# Altium project EL.T01.CVCM.PrjPcb (part 2 of 2)

## Sheet ISO_I2C.SchDoc
size A4; SheetNumber: 5; SheetTotal: 7
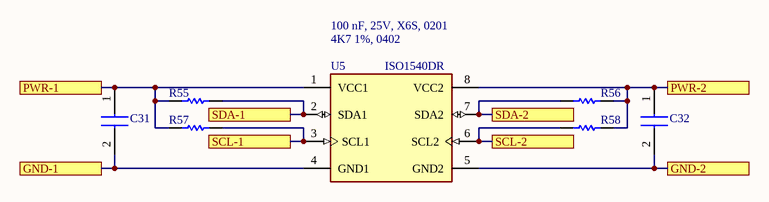
[diagram p4: ISO_I2C.SchDoc]

### Parts
C31  100 nF, 25V, X6S, 0201  [CAPC0603X33N]  (value not drawn)
C32  100 nF, 25V, X6S, 0201  [CAPC0603X33N]  (value not drawn)
R55  4K7 1%, 0402  [RESC1005X40X25LL05T05]  (value not drawn)
R56  4K7 1%, 0402  [RESC1005X40X25LL05T05]  (value not drawn)
R57  4K7 1%, 0402  [RESC1005X40X25LL05T05]  (value not drawn)
R58  4K7 1%, 0402  [RESC1005X40X25LL05T05]  (value not drawn)
U5  ISO1540DR  [FP-D0008A-MFG]

### Ports
GND-1 (see CellVoltageControl[2C]), GND-2 (see CellVoltageControl[3C]), PWR-1 (see CellVoltageControl[2C]), PWR-2 (see CellVoltageControl[3C]), SCL-1 (see CellVoltageControl[2C]), SCL-2 (see CellVoltageControl[3C]), SDA-1 (see CellVoltageControl[2C]), SDA-2 (see CellVoltageControl[3C])

### Nets
3V3: C31.1 R55.2 R57.2 U5.1(VCC1) ; port PWR-1
GND: C31.2 U5.4(GND1) ; port GND-1
ISO_5V: C32.1 R56.1 R58.1 U5.8(VCC2) ; port PWR-2
ISO_GND: C32.2 U5.5(GND2) ; port GND-2
ISO_SCL: R58.2 U5.6(SCL2) ; port SCL-2
ISO_SDA: R56.2 U5.7(SDA2) ; port SDA-2
SCL: R55.1 U5.2(SDA1) ; port SDA-1
SDA: R57.1 U5.3(SCL1) ; port SCL-1

### Notes on the sheet
- 100 nF, 25V, X6S, 0201
- (near U5) 4K7 1%, 0402

### Library data of the parts
C31 C32 = GRM033C81E104KE14D: Capacitor; Manufacturer_Name: Murata Electronics; Datasheet Link: https://search.murata.co.jp/Ceramy/image/img/A01X/G101/ENG/GRM033C81E104KE14-01A.pdf; Height: 0.33mm; Manufacturer_Part_Number: GRM033C81E104KE14D; Mouser Part Number: 81-GRM33C81E104KE14D; Mouser Price/Stock: https://www.mouser.co.uk/ProductDetail/Murata-Electronics/GRM033C81E104KE14D?qs=P%2FC4Eoq9CDwxe7d5nXqGrA%3D%3D; Arrow Part Number: GRM033C81E104KE14D; Arrow Price/Stock: https://www.arrow.com/en/products/grm033c81e104ke14d/murata-manufacturing
R55-R58 = CMP-2002-01154-4: Chip Resistor, 4.7 KOhm, +/- 1%, 0.1 W, -55 to 155 degC, 0402 (1005 Metric), RoHS, Tape and Reel; PartNumber: ERJ-2RKF4701X; Voltage Rating: 50 V; Case\/Package: 0402; Power Rating: 100 mW; Height: 0.35 mm; Mounting Technology: Surface Mount; REACH SVHC: Yes; Resistance: 4.7 KOhm; Max Operating Temperature: 155 degC; ComponentLink1Description: Manufacturer URL; ComponentLink2Description: Datasheet; Pins: 2; PackageReference: 0402; Tolerance: 1%; Case Code (Imperial): 0402; Length: 1 mm; PackageDescription: 2-Pin Surface Mount Device, Body 1 x 0.5 mm; RoHSCompliant: true; Package Quantity: 1; Radiation Hardening: No; DatasheetVersion: 04/2015; Width: 0.5 mm; Case Code (Metric): 1005; Mount: Surface Mount; ComponentLink1URL: http://www.panasonic.com/; Min Operating Temperature: -55 degC; Packaging: Cut Tape; ComponentLink2URL: http://industrial.panasonic.com/cdbs/www-data/pdf/RDA0000/AOA0000C86.pdf
U5 = CMP-04872-000011-1: DGTL ISO 2.5KV 2CH I2C 8SOIC; Manufacturer: Texas Instruments; Max Supply Voltage: 5.5V; Interface: I2C,SMBus,Other; Nominal Supply Current: 1.7-3.1mA; Standoff Height: 0.11mm; Max Junction Temp: +136°C; Min Supply Voltage: 3V; Ipc Land Pattern Name: SOIC127P600X175-8; Ambient Temperature Range Low: -40°C; Temperature: -40°C to +125°C; Device Class L3: unset; Mouser Description: Digital Isolators Low-Power,Bidirec I2C Iso; Manufacturer Part Number: ISO1540DR; Octopart: https://octopart.com/iso1540dr-texas+instruments-24334113; Digikey Description: DGTL ISO 2.5KV 2CH I2C 8SOIC; Category: IC; Height: 1.75mm; Ambient Temperature Range High: +125°C; RoHS: TRUE; Automotive: No; Package: D0008A; ComponentLink2URL: http://www.ti.com/lit/ds/symlink/iso1540.pdf; Device Class L2: Interface ICs; Device Class L1: Integrated Circuits (ICs); Temperature Range Low: -40°C; Lead Free: Yes; ComponentLink2Description: Datasheet; Temperature Range High: +125°C

## Sheet Single-ADC_ADS1252U.SchDoc
size A4; SheetNumber: 6; SheetTotal: 7
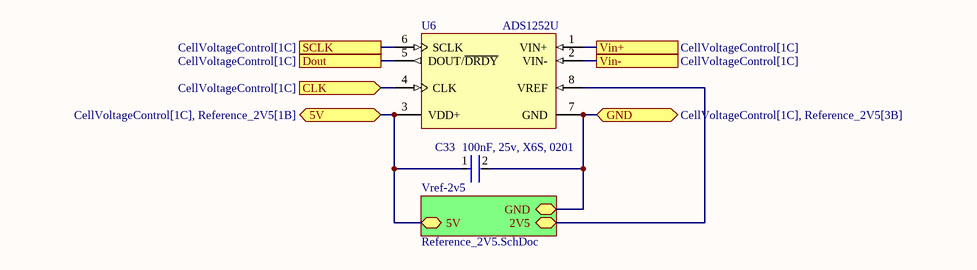
[diagram p5: Single-ADC_ADS1252U.SchDoc]

### Parts
C33  100nF, 25v, X6S, 0201  [FP-GRM033-0_03-IPC_B]
U6  ADS1252U  [TI-D8_M]

### Sub-sheets
Vref-2v5 = Reference_2V5.SchDoc: 2V5 (bidir), 5V (bidir), GND (bidir)

### Ports
5V (bidir, see CellVoltageControl[1C], Reference_2V5[1B]), CLK (in, see CellVoltageControl[1C]), Dout (see CellVoltageControl[1C]), GND (bidir, see CellVoltageControl[1C], Reference_2V5[3B]), SCLK (see CellVoltageControl[1C]), Vin+ (see CellVoltageControl[1C]), Vin- (see CellVoltageControl[1C])

### Nets
ISO_5V: C33.1 U6.3(VDD+) ; port 5V, sheet Vref-2v5/5V
ISO_GND: C33.2 U6.7(GND) ; port GND, sheet Vref-2v5/GND
ISO_SCL: U6.6(SCLK) ; port SCLK
ISO_SDA: U6.5(DOUT/~{DRDY}) ; port Dout
V+: U6.1(VIN+) ; port Vin+
NetC20_2: U6.8(VREF) ; sheet Vref-2v5/2V5
NetU6_2: U6.2(VIN-) ; port Vin-
NetU6_4: U6.4(CLK) ; port CLK

### Library data of the parts
C33 = CMP-06035-023320-1: Chip Multilayer Ceramic Capacitors for General Purpose, 0201, 0.10uF, X6S, 22%, 10%, 25V; Height: 0.3mm; Width: 0.3mm; Weight: 1.2E-05oz; Min Operating Temperature: -55°C; Dielectric: X6S; Packaging: Tape and Reel; Tolerance: 10%; Mount: Surface Mount; Case Code (Imperial): 0201; Case/Package: 0201; Max Operating Temperature: 105°C; Case Code (Metric): 0603; Voltage Rating: 25V; Capacitance: 100nF; Package Quantity: 15000; Thickness: 0.013inch; Length: 0.024inch; Termination: SMD/SMT; Voltage Rating (DC): 25V
U6 = CMP-0003-00072-2: ResolutionPlus 24-Bit, 40 kHz ADC, -40 to 85 degC, 8-pin SOIC (D8), Green (RoHS & no Sb/Br); Manufacturer: Texas Instruments; Analog Voltage AV/DD(Max)(V): 5.25; # Input Channels: 1; Architecture: Delta-Sigma; Sample Rate (max)(SPS): 41k; Digital Supply(Min)(V): 4.75; Resolution(Bits): 24; Interface: Serial SPI; SubFamily: Precision ADC (<=10MSPS); ComponentLink1URL: http://www.ti.com/; Code_JEDEC: MS-012; ComponentLink3Description: Package Specification; PackageVersion: 4040047-3/M, 06/2011; PackageReference: D8; ComponentLink2URL: http://www.ti.com/general/docs/lit/getliterature.tsp?genericPartNumber=ADS1252&fileType=pdf; INL(Max)(+/-LSB): 1; DatasheetVersion: SBAS127D; ComponentLink3URL: http://www.ti.com/litv/pdf/msoi002j; Mounting Technology: Surface Mount; ComponentLink1Description: Manufacturer URL; PackageDescription: 8-Pin Plastic Small Outline, Body 4.9 x 3.9 mm, Pitch 1.27 mm; PartNumber: ADS1252U; Analog Voltage AV/DD(Min)(V): 4.75; ComponentLink2Description: Datasheet; Eco-Plan: Green (RoHS & no Sb/Br); Digital Supply(Max)(V): 5.25

## Sheet Reference_2V5.SchDoc
size A4; SheetNumber: 7; SheetTotal: 7
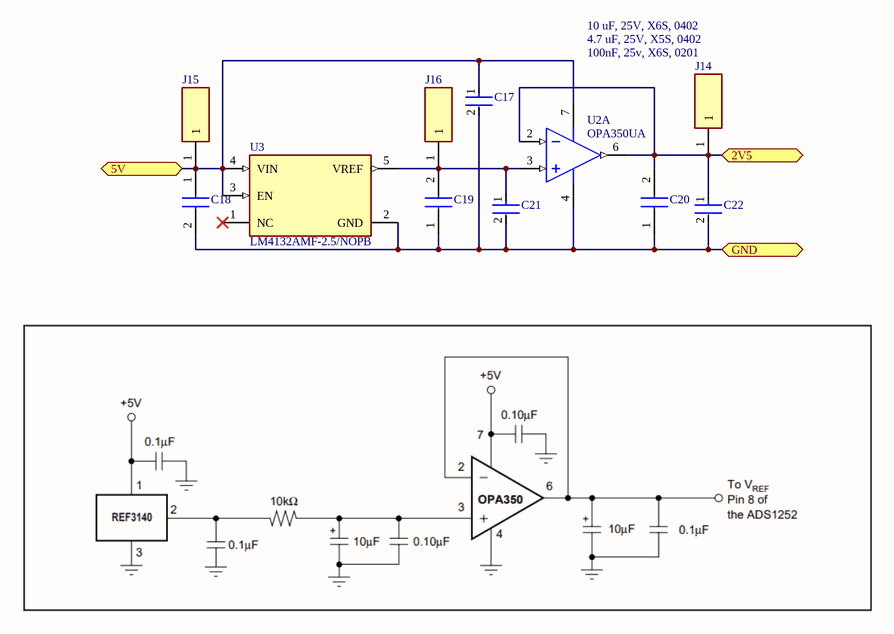
[diagram p6: Reference_2V5.SchDoc]

### Parts
C17  100nF, 25v, X6S, 0201  [FP-GRM033-0_03-IPC_B]  (value not drawn)
C18  10 uF, 25V, X6S, 0402  [CAPC1005X70N]  (value not drawn)
C19  4.7 uF, 25V, X5S, 0402  [GRM15x]  (value not drawn)
C20  10 uF, 25V, X6S, 0402  [CAPC1005X70N]  (value not drawn)
C21  100nF, 25v, X6S, 0201  [FP-GRM033-0_03-IPC_B]  (value not drawn)
C22  100nF, 25v, X6S, 0201  [FP-GRM033-0_03-IPC_B]  (value not drawn)
J14  TestPad  [TestPad]  (value not drawn)  (no BOM)
J15  TestPad  [TestPad]  (value not drawn)  (no BOM)
J16  TestPad  [TestPad]  (value not drawn)  (no BOM)
U2  OPA350UA  [D0008A_M]  (part A of 2)
U3  LM4132AMF-2.5/NOPB  [FP-DBV0005A-IPC_C]

### Ports
2V5 (bidir, see Single-ADC_ADS1252U[3C]), 5V (bidir, see Single-ADC_ADS1252U[2C]), GND (bidir, see Single-ADC_ADS1252U[3C])

### Nets
ISO_5V: C17.1 C18.1 J15.1 U2.7(V+) U3.3(EN) U3.4(VIN) ; port 5V
ISO_GND: C17.2 C18.2 C19.1 C20.1 C21.2 C22.2 U2.4(V-) U3.2(GND) ; port GND
NetC19_2: C19.2 C21.1 J16.1 U2.3(IN+) U3.5(VREF)
NetC20_2: C20.2 C22.1 J14.1 U2.2(IN-) U2.6(OUT) ; port 2V5

Not connected (* = marked no-connect by the designer): U3 1(NC)*

### Notes on the sheet
- 10 uF, 25V, X6S, 0402
- 100nF, 25v, X6S, 0201
- 4.7 uF, 25V, X5S, 0402

### Library data of the parts
C17 C21 C22 = CMP-06035-023320-1: as C33 on sheet Single-ADC_ADS1252U; Height: 0.3mm; Width: 0.3mm; Weight: 1.2E-05oz; Min Operating Temperature: -55°C; Dielectric: X6S; Packaging: Tape and Reel; Tolerance: 10%; Mount: Surface Mount; Case Code (Imperial): 0201; Case/Package: 0201; Max Operating Temperature: 105°C; Case Code (Metric): 0603; Voltage Rating: 25V; Capacitance: 100nF; Package Quantity: 15000; Thickness: 0.013inch; Length: 0.024inch; Termination: SMD/SMT; Voltage Rating (DC): 25V
C18 C20 = GRM155F51E104ZA01E: Capacitor; Manufacturer_Name: Murata Electronics; Datasheet Link: http://www.murata.com/~/media/webrenewal/support/library/catalog/products/capacitor/mlcc/c02e.pdf; Height: 0.7mm; Manufacturer_Part_Number: GRM155F51E104ZA01E; Mouser Part Number: 81-GRM15F51E104ZA01E; Mouser Price/Stock: https://www.mouser.com/Search/Refine.aspx?Keyword=81-GRM15F51E104ZA01E
C19 = GRM155C61E475ME15J: Capacitor; Manufacturer_Name: Murata Electronics; Datasheet Link: https://search.murata.co.jp/Ceramy/image/img/A01X/G101/ENG/GRM155C61E475ME15-01A.pdf; Height: 0.33mm; Manufacturer_Part_Number: GRM155C61E475ME15J; Mouser Part Number: 81-GRM15C61E475ME15J; Mouser Price/Stock: https://www.mouser.co.uk/ProductDetail/Murata-Electronics/GRM155C61E475ME15J?qs=By6Nw2ByBD02p8xq06vhEQ%3D%3D; Arrow Part Number: GRM155C61E475ME15J; Arrow Price/Stock: https://www.arrow.com/en/products/grm155c61e475me15j/murata-manufacturing?region=nac
J14-J16 = 61300111121: Connector; Manufacturer_Name: Wurth Elektronik; Datasheet Link: https://katalog.we-online.de/em/datasheet/6130xx11121.pdf; Height: 8.89mm; Manufacturer_Part_Number: 61300111121; Mouser Part Number: 710-61300111121; Mouser Price/Stock: https://www.mouser.co.uk/ProductDetail/Wurth-Elektronik/61300111121?qs=PhR8RmCirEaRH5Ck%252B2lRLQ%3D%3D
U2 = CMP-0271-00145-3: High-Speed, Single-Supply, Rail-to-Rail Operational Amplifier MicroAmplifier(TM) Series, 2.7 to 5.5 V, -40 to 85 degC, 8-pin SOIC (D8), Green (RoHS & no Sb/Br); Manufacturer: Texas Instruments; IIB(Max)(pA): 10; Iq per channel(Max)(mA): 8.5; Number of Channels: 1; CMRR(Min)(dB): 66; Slew Rate(Typ)(V/us): 22; Total Supply Voltage(Max)(+5V is 5, +/-5V is 10): 5.5; Sub Family: Low Input Bias Current Amp (<=10pA), Low Offset Voltage Amplifier (<=500uV), Low Supply Voltage Amplifier (<=2.7V), Precision Amplifier; Offset Drift(Typ)(uV/C): 4; Total Supply Voltage(Min)(+5V is 5, +/-5V is 10): 2.7; Vn at 1kHz(Typ)(nV/rtHz): 18; PackageReference: D0008A; PackageDescription: 8-Pin Plastic Small Outline, Body 4.9 x 3.9 mm, Pitch 1.27 mm; Code_JEDEC: MS-012; Eco-Plan: Green (RoHS & no Sb/Br); DatasheetVersion: SBOS099C; Vio (25C)(Max)(mV): 1; ComponentLink1URL: http://www.ti.com/; ComponentLink3URL: http://www.ti.com/litv/pdf/msoi002j; PackageVersion: 4040047-3/M, 06/2011; ComponentLink3Description: Package Specification; ComponentLink2URL: http://www.ti.com/general/docs/lit/getliterature.tsp?genericPartNumber=OPA350&fileType=pdf; PartNumber: OPA350UA; ComponentLink2Description: Datasheet; ComponentLink1Description: Manufacturer URL; Mounting Technology: Surface Mount
U3 = CMP-0074-00531-5: IC VREF SERIES 0.05% SOT23-5; Quiescent Current: 100uA; Output Current: 20mA; Number of Channels: 1; Temperature Coefficient: 20ppm/°C; Max Input Voltage: 6V; Output Voltage: 2.5V; Max Supply Voltage: 2.2V; Dropout Voltage: 175mV; Supply Current: 60uA; Output Type: Fixed; Length: 2.92mm; Radiation Hardening: No; Reference Type: Series; Mount: Surface Mount; Packaging: Tape and Reel; Width: 1.6mm; Max Operating Temperature: 125°C; Lead Free: Lead Free; Series: -; Number of Pins: 5; REACH SVHC: No SVHC; Max Output Voltage: 2.5V; Package Quantity: 1000; Tolerance: 0.05%; Min Input Voltage: 2.2V; Case/Package: SOT-23; Termination: SMD/SMT; Height: 1.02mm; Min Output Voltage: 2.5V; Reference Voltage: 2.5V; Max Output Current: 20mA; Nominal Supply Current: 60uA; Min Operating Temperature: -40°C; Operating Supply Current: 100uA

## Nets that join several sheets
3V3: CellVoltageControl (21 pins), LDO_3V3 (C23.1 C24.1 IC1.2), ISO_I2C (C31.1 R55.2 R57.2 U5.1)
5V: CellVoltageControl (J10.1 P1.7 P1.8), LDO_3V3 (C25.1 C26.1 IC1.3), ISO_Power (C29.2 C30.2 R54.2 U4.3)
GND: CellVoltageControl (30 pins), CellSelectModule (K1_CellSelectModule#1.2), CellSelectModule (K1_CellSelectModule#2.2), CellSelectModule (K1_CellSelectModule#3.2), CellSelectModule (K1_CellSelectModule#4.2), CellSelectModule (K1_CellSelectModule#5.2), CellSelectModule (K1_CellSelectModule#6.2), CellSelectModule (K1_CellSelectModule#7.2), CellSelectModule (K1_CellSelectModule#8.2), CellSelectModule (K1_CellSelectModule#9.2), CellSelectModule (K1_CellSelectModule#10.2), CellSelectModule (K1_CellSelectModule#11.2), CellSelectModule (K1_CellSelectModule#12.2), CellSelectModule (K1_CellSelectModule#13.2), CellSelectModule (K1_CellSelectModule#14.2), CellSelectModule (K1_CellSelectModule#15.2), CellSelectModule (K1_CellSelectModule#16.2), CellSelectModule (K1_CellSelectModule#17.2), CellSelectModule (K1_CellSelectModule#18.2), CellSelectModule (K1_CellSelectModule#19.2), CellSelectModule (K1_CellSelectModule#20.2), CellSelectModule (K1_CellSelectModule#21.2), CellSelectModule (K1_CellSelectModule#22.2), CellSelectModule (K1_CellSelectModule#23.2), CellSelectModule (K1_CellSelectModule#24.2), CellSelectModule (K1_CellSelectModule#25.2), CellSelectModule (K1_CellSelectModule#26.2), CellSelectModule (K1_CellSelectModule#27.2), CellSelectModule (K1_CellSelectModule#28.2), CellSelectModule (K1_CellSelectModule#29.2), CellSelectModule (K1_CellSelectModule#30.2), CellSelectModule (K1_CellSelectModule#31.2), CellSelectModule (K1_CellSelectModule#32.2), CellSelectModule (K1_CellSelectModule#33.2), CellSelectModule (K1_CellSelectModule#34.2), CellSelectModule (K1_CellSelectModule#35.2), CellSelectModule (K1_CellSelectModule#36.2), CellSelectModule (K1_CellSelectModule#37.2), CellSelectModule (K1_CellSelectModule#38.2), CellSelectModule (K1_CellSelectModule#39.2), CellSelectModule (K1_CellSelectModule#40.2), CellSelectModule (K1_CellSelectModule#41.2), CellSelectModule (K1_CellSelectModule#42.2), CellSelectModule (K1_CellSelectModule#43.2), CellSelectModule (K1_CellSelectModule#44.2), CellSelectModule (K1_CellSelectModule#45.2), CellSelectModule (K1_CellSelectModule#46.2), CellSelectModule (K1_CellSelectModule#47.2), CellSelectModule (K1_CellSelectModule#48.2), LDO_3V3 (5 pins), ISO_Power (6 pins), ISO_I2C (C31.2 U5.4)
ISO_5V: CellVoltageControl (J11.1), ISO_Power (C27.1 C28.1 U4.14), ISO_I2C (C32.1 R56.1 R58.1 U5.8), Single-ADC_ADS1252U (C33.1 U6.3), Reference_2V5 (6 pins)
ISO_GND: CellVoltageControl (J13.1 R50.1), ISO_Power (9 pins), ISO_I2C (C32.2 U5.5), Single-ADC_ADS1252U (C33.2 U6.7), Reference_2V5 (8 pins)
cCell-1: CellVoltageControl (U1.55), CellSelectModule (R1_CellSelectModule#1.1)
cCell-2: CellVoltageControl (U1.53), CellSelectModule (R1_CellSelectModule#37.1)
cCell-3: CellVoltageControl (U1.51), CellSelectModule (R1_CellSelectModule#38.1)
cCell-4: CellVoltageControl (U1.97), CellSelectModule (R1_CellSelectModule#39.1)
cCell-5: CellVoltageControl (U1.96), CellSelectModule (R1_CellSelectModule#40.1)
cCell-6: CellVoltageControl (U1.95), CellSelectModule (R1_CellSelectModule#41.1)
cCell-7: CellVoltageControl (U1.91), CellSelectModule (R1_CellSelectModule#42.1)
cCell-8: CellVoltageControl (U1.84), CellSelectModule (R1_CellSelectModule#43.1)
cCell-9: CellVoltageControl (U1.85), CellSelectModule (R1_CellSelectModule#44.1)
cCell-10: CellVoltageControl (U1.86), CellSelectModule (R1_CellSelectModule#45.1)
cCell-11: CellVoltageControl (U1.87), CellSelectModule (R1_CellSelectModule#46.1)
cCell-12: CellVoltageControl (U1.88), CellSelectModule (R1_CellSelectModule#47.1)
cCell-13: CellVoltageControl (U1.90), CellSelectModule (R1_CellSelectModule#48.1)
cCell-14: CellVoltageControl (U1.98), CellSelectModule (R1_CellSelectModule#25.1)
cCell-15: CellVoltageControl (U1.32), CellSelectModule (R1_CellSelectModule#26.1)
cCell-16: CellVoltageControl (U1.30), CellSelectModule (R1_CellSelectModule#27.1)
cCell-17: CellVoltageControl (U1.29), CellSelectModule (R1_CellSelectModule#28.1)
cCell-18: CellVoltageControl (U1.52), CellSelectModule (R1_CellSelectModule#29.1)
cCell-19: CellVoltageControl (U1.56), CellSelectModule (R1_CellSelectModule#30.1)
cCell-20: CellVoltageControl (U1.57), CellSelectModule (R1_CellSelectModule#31.1)
cCell-21: CellVoltageControl (U1.31), CellSelectModule (R1_CellSelectModule#32.1)
cCell-22: CellVoltageControl (U1.33), CellSelectModule (R1_CellSelectModule#33.1)
cCell-23: CellVoltageControl (U1.34), CellSelectModule (R1_CellSelectModule#34.1)
cCell-24: CellVoltageControl (U1.54), CellSelectModule (R1_CellSelectModule#35.1)
cCell-25: CellVoltageControl (U1.61), CellSelectModule (R1_CellSelectModule#36.1)
cCell-26: CellVoltageControl (U1.60), CellSelectModule (R1_CellSelectModule#13.1)
cCell-27: CellVoltageControl (U1.59), CellSelectModule (R1_CellSelectModule#14.1)
cCell-28: CellVoltageControl (U1.58), CellSelectModule (R1_CellSelectModule#15.1)
cCell-29: CellVoltageControl (U1.62), CellSelectModule (R1_CellSelectModule#16.1)
cCell-30: CellVoltageControl (U1.67), CellSelectModule (R1_CellSelectModule#17.1)
cCell-31: CellVoltageControl (U1.71), CellSelectModule (R1_CellSelectModule#18.1)
cCell-32: CellVoltageControl (U1.78), CellSelectModule (R1_CellSelectModule#19.1)
cCell-33: CellVoltageControl (U1.79), CellSelectModule (R1_CellSelectModule#20.1)
cCell-34: CellVoltageControl (U1.80), CellSelectModule (R1_CellSelectModule#21.1)
cCell-35: CellVoltageControl (U1.81), CellSelectModule (R1_CellSelectModule#22.1)
cCell-36: CellVoltageControl (U1.82), CellSelectModule (R1_CellSelectModule#23.1)
cCell-37: CellVoltageControl (U1.83), CellSelectModule (R1_CellSelectModule#24.1)
cCell-38: CellVoltageControl (U1.70), CellSelectModule (R1_CellSelectModule#2.1)
cCell-39: CellVoltageControl (U1.69), CellSelectModule (R1_CellSelectModule#3.1)
cCell-40: CellVoltageControl (U1.68), CellSelectModule (R1_CellSelectModule#4.1)
cCell-41: CellVoltageControl (U1.66), CellSelectModule (R1_CellSelectModule#5.1)
cCell-42: CellVoltageControl (U1.65), CellSelectModule (R1_CellSelectModule#6.1)
cCell-43: CellVoltageControl (U1.64), CellSelectModule (R1_CellSelectModule#7.1)
cCell-44: CellVoltageControl (U1.63), CellSelectModule (R1_CellSelectModule#8.1)
cCell-45: CellVoltageControl (U1.43), CellSelectModule (R1_CellSelectModule#9.1)
cCell-46: CellVoltageControl (U1.44), CellSelectModule (R1_CellSelectModule#10.1)
cCell-47: CellVoltageControl (U1.45), CellSelectModule (R1_CellSelectModule#11.1)
cCell-48: CellVoltageControl (U1.46), CellSelectModule (R1_CellSelectModule#12.1)
ISO_SCL: CellVoltageControl (J5.1), ISO_I2C (R58.2 U5.6), Single-ADC_ADS1252U (U6.6)
ISO_SDA: CellVoltageControl (J3.1), ISO_I2C (R56.2 U5.7), Single-ADC_ADS1252U (U6.5)
NetC20_2: Single-ADC_ADS1252U (U6.8), Reference_2V5 (5 pins)
NetK1_CellSelectModule#1_4: CellVoltageControl (R2.1), CellSelectModule (K1_CellSelectModule#1.4)
NetK1_CellSelectModule#2_4: CellVoltageControl (R9.1), CellSelectModule (K1_CellSelectModule#2.4)
NetK1_CellSelectModule#3_4: CellVoltageControl (R13.1), CellSelectModule (K1_CellSelectModule#3.4)
NetK1_CellSelectModule#4_4: CellVoltageControl (R17.1), CellSelectModule (K1_CellSelectModule#4.4)
NetK1_CellSelectModule#5_4: CellVoltageControl (R21.1), CellSelectModule (K1_CellSelectModule#5.4)
NetK1_CellSelectModule#6_4: CellVoltageControl (R25.1), CellSelectModule (K1_CellSelectModule#6.4)
NetK1_CellSelectModule#7_4: CellVoltageControl (R29.1), CellSelectModule (K1_CellSelectModule#7.4)
NetK1_CellSelectModule#8_4: CellVoltageControl (R33.1), CellSelectModule (K1_CellSelectModule#8.4)
NetK1_CellSelectModule#9_4: CellVoltageControl (R37.1), CellSelectModule (K1_CellSelectModule#9.4)
NetK1_CellSelectModule#10_4: CellVoltageControl (R41.1), CellSelectModule (K1_CellSelectModule#10.4)
NetK1_CellSelectModule#11_4: CellVoltageControl (R45.1), CellSelectModule (K1_CellSelectModule#11.4)
NetK1_CellSelectModule#12_4: CellVoltageControl (R49.1), CellSelectModule (K1_CellSelectModule#12.4)
NetK1_CellSelectModule#13_4: CellVoltageControl (R8.1), CellSelectModule (K1_CellSelectModule#13.4)
NetK1_CellSelectModule#14_4: CellVoltageControl (R12.1), CellSelectModule (K1_CellSelectModule#14.4)
NetK1_CellSelectModule#15_4: CellVoltageControl (R16.1), CellSelectModule (K1_CellSelectModule#15.4)
NetK1_CellSelectModule#16_4: CellVoltageControl (R20.1), CellSelectModule (K1_CellSelectModule#16.4)
NetK1_CellSelectModule#17_4: CellVoltageControl (R24.1), CellSelectModule (K1_CellSelectModule#17.4)
NetK1_CellSelectModule#18_4: CellVoltageControl (R28.1), CellSelectModule (K1_CellSelectModule#18.4)
NetK1_CellSelectModule#19_4: CellVoltageControl (R32.1), CellSelectModule (K1_CellSelectModule#19.4)
NetK1_CellSelectModule#20_4: CellVoltageControl (R36.1), CellSelectModule (K1_CellSelectModule#20.4)
NetK1_CellSelectModule#21_4: CellVoltageControl (R40.1), CellSelectModule (K1_CellSelectModule#21.4)
NetK1_CellSelectModule#22_4: CellVoltageControl (R44.1), CellSelectModule (K1_CellSelectModule#22.4)
NetK1_CellSelectModule#23_4: CellVoltageControl (R48.1), CellSelectModule (K1_CellSelectModule#23.4)
NetK1_CellSelectModule#24_4: CellVoltageControl (R5.1), CellSelectModule (K1_CellSelectModule#24.4)
NetK1_CellSelectModule#25_4: CellVoltageControl (R7.1), CellSelectModule (K1_CellSelectModule#25.4)
NetK1_CellSelectModule#26_4: CellVoltageControl (R11.1), CellSelectModule (K1_CellSelectModule#26.4)
NetK1_CellSelectModule#27_4: CellVoltageControl (R15.1), CellSelectModule (K1_CellSelectModule#27.4)
NetK1_CellSelectModule#28_4: CellVoltageControl (R19.1), CellSelectModule (K1_CellSelectModule#28.4)
NetK1_CellSelectModule#29_4: CellVoltageControl (R23.1), CellSelectModule (K1_CellSelectModule#29.4)
NetK1_CellSelectModule#30_4: CellVoltageControl (R27.1), CellSelectModule (K1_CellSelectModule#30.4)
NetK1_CellSelectModule#31_4: CellVoltageControl (R31.1), CellSelectModule (K1_CellSelectModule#31.4)
NetK1_CellSelectModule#32_4: CellVoltageControl (R35.1), CellSelectModule (K1_CellSelectModule#32.4)
NetK1_CellSelectModule#33_4: CellVoltageControl (R39.1), CellSelectModule (K1_CellSelectModule#33.4)
NetK1_CellSelectModule#34_4: CellVoltageControl (R43.1), CellSelectModule (K1_CellSelectModule#34.4)
NetK1_CellSelectModule#35_4: CellVoltageControl (R47.1), CellSelectModule (K1_CellSelectModule#35.4)
NetK1_CellSelectModule#36_4: CellVoltageControl (R4.1), CellSelectModule (K1_CellSelectModule#36.4)
NetK1_CellSelectModule#37_4: CellVoltageControl (R6.1), CellSelectModule (K1_CellSelectModule#37.4)
NetK1_CellSelectModule#38_4: CellVoltageControl (R10.1), CellSelectModule (K1_CellSelectModule#38.4)
NetK1_CellSelectModule#39_4: CellVoltageControl (R14.1), CellSelectModule (K1_CellSelectModule#39.4)
NetK1_CellSelectModule#40_4: CellVoltageControl (R18.1), CellSelectModule (K1_CellSelectModule#40.4)
NetK1_CellSelectModule#41_4: CellVoltageControl (R22.1), CellSelectModule (K1_CellSelectModule#41.4)
NetK1_CellSelectModule#42_4: CellVoltageControl (R26.1), CellSelectModule (K1_CellSelectModule#42.4)
NetK1_CellSelectModule#43_4: CellVoltageControl (R30.1), CellSelectModule (K1_CellSelectModule#43.4)
NetK1_CellSelectModule#44_4: CellVoltageControl (R34.1), CellSelectModule (K1_CellSelectModule#44.4)
NetK1_CellSelectModule#45_4: CellVoltageControl (R38.1), CellSelectModule (K1_CellSelectModule#45.4)
NetK1_CellSelectModule#46_4: CellVoltageControl (R42.1), CellSelectModule (K1_CellSelectModule#46.4)
NetK1_CellSelectModule#47_4: CellVoltageControl (R46.1), CellSelectModule (K1_CellSelectModule#47.4)
NetK1_CellSelectModule#48_4: CellVoltageControl (R3.1), CellSelectModule (K1_CellSelectModule#48.4)
SCL: CellVoltageControl (J2.1 U1.92), ISO_I2C (R55.1 U5.2)
SDA: CellVoltageControl (J1.1 U1.93), ISO_I2C (R57.1 U5.3)
V+: CellVoltageControl (J8.1 R50.2), CellSelectModule (K1_CellSelectModule#1.3), CellSelectModule (K1_CellSelectModule#2.3), CellSelectModule (K1_CellSelectModule#3.3), CellSelectModule (K1_CellSelectModule#4.3), CellSelectModule (K1_CellSelectModule#5.3), CellSelectModule (K1_CellSelectModule#6.3), CellSelectModule (K1_CellSelectModule#7.3), CellSelectModule (K1_CellSelectModule#8.3), CellSelectModule (K1_CellSelectModule#9.3), CellSelectModule (K1_CellSelectModule#10.3), CellSelectModule (K1_CellSelectModule#11.3), CellSelectModule (K1_CellSelectModule#12.3), CellSelectModule (K1_CellSelectModule#13.3), CellSelectModule (K1_CellSelectModule#14.3), CellSelectModule (K1_CellSelectModule#15.3), CellSelectModule (K1_CellSelectModule#16.3), CellSelectModule (K1_CellSelectModule#17.3), CellSelectModule (K1_CellSelectModule#18.3), CellSelectModule (K1_CellSelectModule#19.3), CellSelectModule (K1_CellSelectModule#20.3), CellSelectModule (K1_CellSelectModule#21.3), CellSelectModule (K1_CellSelectModule#22.3), CellSelectModule (K1_CellSelectModule#23.3), CellSelectModule (K1_CellSelectModule#24.3), CellSelectModule (K1_CellSelectModule#25.3), CellSelectModule (K1_CellSelectModule#26.3), CellSelectModule (K1_CellSelectModule#27.3), CellSelectModule (K1_CellSelectModule#28.3), CellSelectModule (K1_CellSelectModule#29.3), CellSelectModule (K1_CellSelectModule#30.3), CellSelectModule (K1_CellSelectModule#31.3), CellSelectModule (K1_CellSelectModule#32.3), CellSelectModule (K1_CellSelectModule#33.3), CellSelectModule (K1_CellSelectModule#34.3), CellSelectModule (K1_CellSelectModule#35.3), CellSelectModule (K1_CellSelectModule#36.3), CellSelectModule (K1_CellSelectModule#37.3), CellSelectModule (K1_CellSelectModule#38.3), CellSelectModule (K1_CellSelectModule#39.3), CellSelectModule (K1_CellSelectModule#40.3), CellSelectModule (K1_CellSelectModule#41.3), CellSelectModule (K1_CellSelectModule#42.3), CellSelectModule (K1_CellSelectModule#43.3), CellSelectModule (K1_CellSelectModule#44.3), CellSelectModule (K1_CellSelectModule#45.3), CellSelectModule (K1_CellSelectModule#46.3), CellSelectModule (K1_CellSelectModule#47.3), CellSelectModule (K1_CellSelectModule#48.3), Single-ADC_ADS1252U (U6.1)